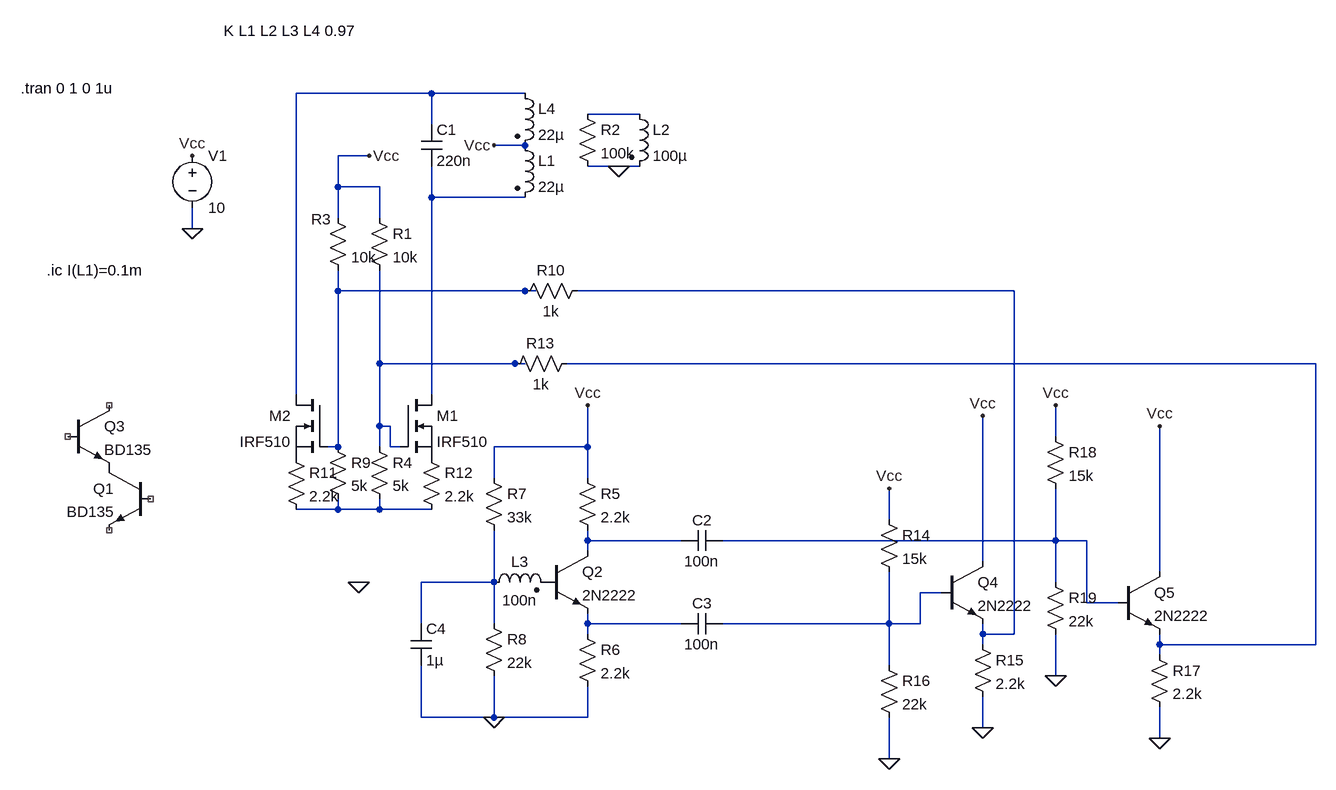
[diagram p0: schematic royer2_mosfet.asc]
royer2_mosfet.asc, the LTspice schematic file:
Version 4
SHEET 1 1604 1060
WIRE 240 16 32 16
WIRE 384 16 240 16
WIRE 560 48 480 48
WIRE 240 64 240 16
WIRE 384 96 336 96
WIRE 144 112 96 112
WIRE 528 128 480 128
WIRE 560 128 528 128
WIRE 96 160 96 112
WIRE 160 160 96 160
WIRE 240 176 240 128
WIRE 384 176 240 176
WIRE 96 208 96 160
WIRE 160 208 160 160
WIRE -128 224 -128 192
WIRE 96 320 96 288
WIRE 384 320 96 320
WIRE 400 320 384 320
WIRE 1136 320 464 320
WIRE 160 432 160 288
WIRE 368 432 160 432
WIRE 384 432 368 432
WIRE 1600 432 448 432
WIRE 32 480 32 16
WIRE 240 480 240 176
WIRE 160 528 160 432
WIRE 176 528 160 528
WIRE 1200 544 1200 496
WIRE 96 560 96 320
WIRE 96 560 80 560
WIRE 160 560 160 528
WIRE 176 560 176 528
WIRE 192 560 176 560
WIRE 480 560 480 496
WIRE 480 560 336 560
WIRE 336 608 336 560
WIRE 480 608 480 560
WIRE 96 656 96 640
WIRE 96 656 32 656
WIRE 160 656 96 656
WIRE 160 656 160 640
WIRE 240 656 160 656
WIRE 944 672 944 624
WIRE 480 704 480 688
WIRE 624 704 480 704
WIRE 1200 704 1200 624
WIRE 1200 704 688 704
WIRE 1248 704 1200 704
WIRE 480 720 480 704
WIRE 1088 736 1088 512
WIRE 1360 752 1360 528
WIRE 336 768 336 688
WIRE 336 768 224 768
WIRE 1200 768 1200 704
WIRE 1024 784 992 784
WIRE 1248 800 1248 704
WIRE 1296 800 1248 800
WIRE 224 832 224 768
WIRE 336 832 336 768
WIRE 480 832 480 816
WIRE 624 832 480 832
WIRE 944 832 944 752
WIRE 944 832 688 832
WIRE 992 832 992 784
WIRE 992 832 944 832
WIRE 480 848 480 832
WIRE 1088 848 1088 832
WIRE 1136 848 1136 320
WIRE 1136 848 1088 848
WIRE 1088 864 1088 848
WIRE 1360 864 1360 848
WIRE 1600 864 1600 432
WIRE 1600 864 1360 864
WIRE 1360 880 1360 864
WIRE 944 896 944 832
WIRE 1200 912 1200 848
WIRE 224 976 224 896
WIRE 336 976 336 912
WIRE 336 976 224 976
WIRE 480 976 480 928
WIRE 480 976 336 976
WIRE 1088 992 1088 944
WIRE 1360 1008 1360 960
WIRE 944 1040 944 976
FLAG -128 224 0
FLAG -128 112 Vcc
FLAG 336 96 Vcc
FLAG 144 112 Vcc
FLAG 528 128 0
FLAG 336 976 0
FLAG 480 496 Vcc
FLAG 128 768 0
FLAG 1088 512 Vcc
FLAG 1088 992 0
FLAG 1360 528 Vcc
FLAG 1360 1008 0
FLAG 944 1040 0
FLAG 1200 912 0
FLAG 944 624 Vcc
FLAG 1200 496 Vcc
SYMBOL voltage -128 96 R0
WINDOW 123 0 0 Left 0
WINDOW 39 0 0 Left 0
SYMATTR InstName V1
SYMATTR Value 10
SYMBOL ind2 368 80 R0
SYMATTR InstName L1
SYMATTR Value 22µ
SYMATTR Type ind
SYMBOL ind2 544 32 R0
SYMATTR InstName L2
SYMATTR Value 100µ
SYMATTR Type ind
SYMBOL ind2 320 784 R270
WINDOW 0 32 56 VTop 2
WINDOW 3 4 56 VBottom 2
SYMATTR InstName L3
SYMATTR Value 100n
SYMATTR Type ind
SYMATTR SpiceLine Rser=0.1
SYMBOL npn -192 592 M0
SYMATTR InstName Q1
SYMATTR Value BD135
SYMBOL ind2 368 0 R0
SYMATTR InstName L4
SYMATTR Value 22µ
SYMATTR Type ind
SYMBOL cap 224 64 R0
SYMATTR InstName C1
SYMATTR Value 220n
SYMBOL res 144 192 R0
SYMATTR InstName R1
SYMATTR Value 10k
SYMBOL res 464 32 R0
SYMATTR InstName R2
SYMATTR Value 100k
SYMBOL npn -320 496 R0
SYMATTR InstName Q3
SYMATTR Value BD135
SYMBOL npn 416 720 R0
SYMATTR InstName Q2
SYMATTR Value 2N2222
SYMBOL res 464 592 R0
SYMATTR InstName R5
SYMATTR Value 2.2k
SYMBOL res 464 832 R0
SYMATTR InstName R6
SYMATTR Value 2.2k
SYMBOL res 320 592 R0
SYMATTR InstName R7
SYMATTR Value 33k
SYMBOL res 320 816 R0
SYMATTR InstName R8
SYMATTR Value 22k
SYMBOL cap 208 832 R0
SYMATTR InstName C4
SYMATTR Value 1µ
SYMBOL cap 688 688 R90
WINDOW 0 0 32 VBottom 2
WINDOW 3 32 32 VTop 2
SYMATTR InstName C2
SYMATTR Value 100n
SYMBOL cap 688 816 R90
WINDOW 0 0 32 VBottom 2
WINDOW 3 32 32 VTop 2
SYMATTR InstName C3
SYMATTR Value 100n
SYMBOL res 80 192 R0
WINDOW 0 -25 18 Left 2
SYMATTR InstName R3
SYMATTR Value 10k
SYMBOL res 16 560 R0
SYMATTR InstName R11
SYMATTR Value 2.2k
SYMBOL res 224 560 R0
SYMATTR InstName R12
SYMATTR Value 2.2k
SYMBOL res 144 544 R0
SYMATTR InstName R4
SYMATTR Value 5k
SYMBOL res 80 544 R0
SYMATTR InstName R9
SYMATTR Value 5k
SYMBOL res 480 304 R90
WINDOW 0 0 56 VBottom 2
WINDOW 3 32 56 VTop 2
SYMATTR InstName R10
SYMATTR Value 1k
SYMBOL res 352 448 R270
WINDOW 0 32 56 VTop 2
WINDOW 3 0 56 VBottom 2
SYMATTR InstName R13
SYMATTR Value 1k
SYMBOL npn 1024 736 R0
SYMATTR InstName Q4
SYMATTR Value 2N2222
SYMBOL res 1072 848 R0
SYMATTR InstName R15
SYMATTR Value 2.2k
SYMBOL npn 1296 752 R0
SYMATTR InstName Q5
SYMATTR Value 2N2222
SYMBOL res 1344 864 R0
SYMATTR InstName R17
SYMATTR Value 2.2k
SYMBOL res 928 656 R0
SYMATTR InstName R14
SYMATTR Value 15k
SYMBOL res 928 880 R0
SYMATTR InstName R16
SYMATTR Value 22k
SYMBOL res 1184 528 R0
SYMATTR InstName R18
SYMATTR Value 15k
SYMBOL res 1184 752 R0
SYMATTR InstName R19
SYMATTR Value 22k
SYMBOL nmos 192 480 R0
SYMATTR InstName M1
SYMATTR Value IRF510
SYMBOL nmos 80 480 M0
SYMATTR InstName M2
SYMATTR Value IRF510
TEXT -80 -80 Left 2 !K L1 L2 L3 L4 0.97
TEXT -392 8 Left 2 !.tran 0 1 0 1u
TEXT -352 288 Left 2 !.ic I(L1)=0.1m

The netlist it stands for:
* royer2_mosfet.asc
V1 Vcc 0 10
L1 Vcc N003 22µ
L2 N002 0 100µ
L3 N011 P001 100n Rser=0.1
Q1 P002 NC_01 NC_02 0 BD135
L4 N001 Vcc 22µ
C1 N001 N003 220n
R1 Vcc N006 10k
R2 N002 0 100k
Q3 NC_03 NC_04 P002 0 BD135
Q2 N009 P001 N013 0 2N2222
R5 Vcc N009 2.2k
R6 N013 0 2.2k
R7 Vcc N011 33k
R8 N011 0 22k
C4 N011 0 1µ
C2 N010 N009 100n
C3 N012 N013 100n
R3 Vcc N004 10k
R11 P003 N008 2.2k
R12 P004 N008 2.2k
R4 N006 N008 5k
R9 N004 N008 5k
R10 N005 N004 1k
R13 N006 N007 1k
Q4 Vcc N012 N005 0 2N2222
R15 N005 0 2.2k
Q5 Vcc N010 N007 0 2N2222
R17 N007 0 2.2k
R14 Vcc N012 15k
R16 N012 0 22k
R18 Vcc N010 15k
R19 N010 0 22k
M1 N003 N006 P004 P004 IRF510
M2 N001 N004 P003 P003 IRF510
.model NPN NPN
.model PNP PNP
.lib standard.bjt
.model NMOS NMOS
.model PMOS PMOS
.lib standard.mos
K L1 L2 L3 L4 0.97
.tran 0 1 0 1u
.ic I(L1)=0.1m
.backanno
.end